# EAGLE schematic ttl-nixie-clock (EAGLE 7.4.0)
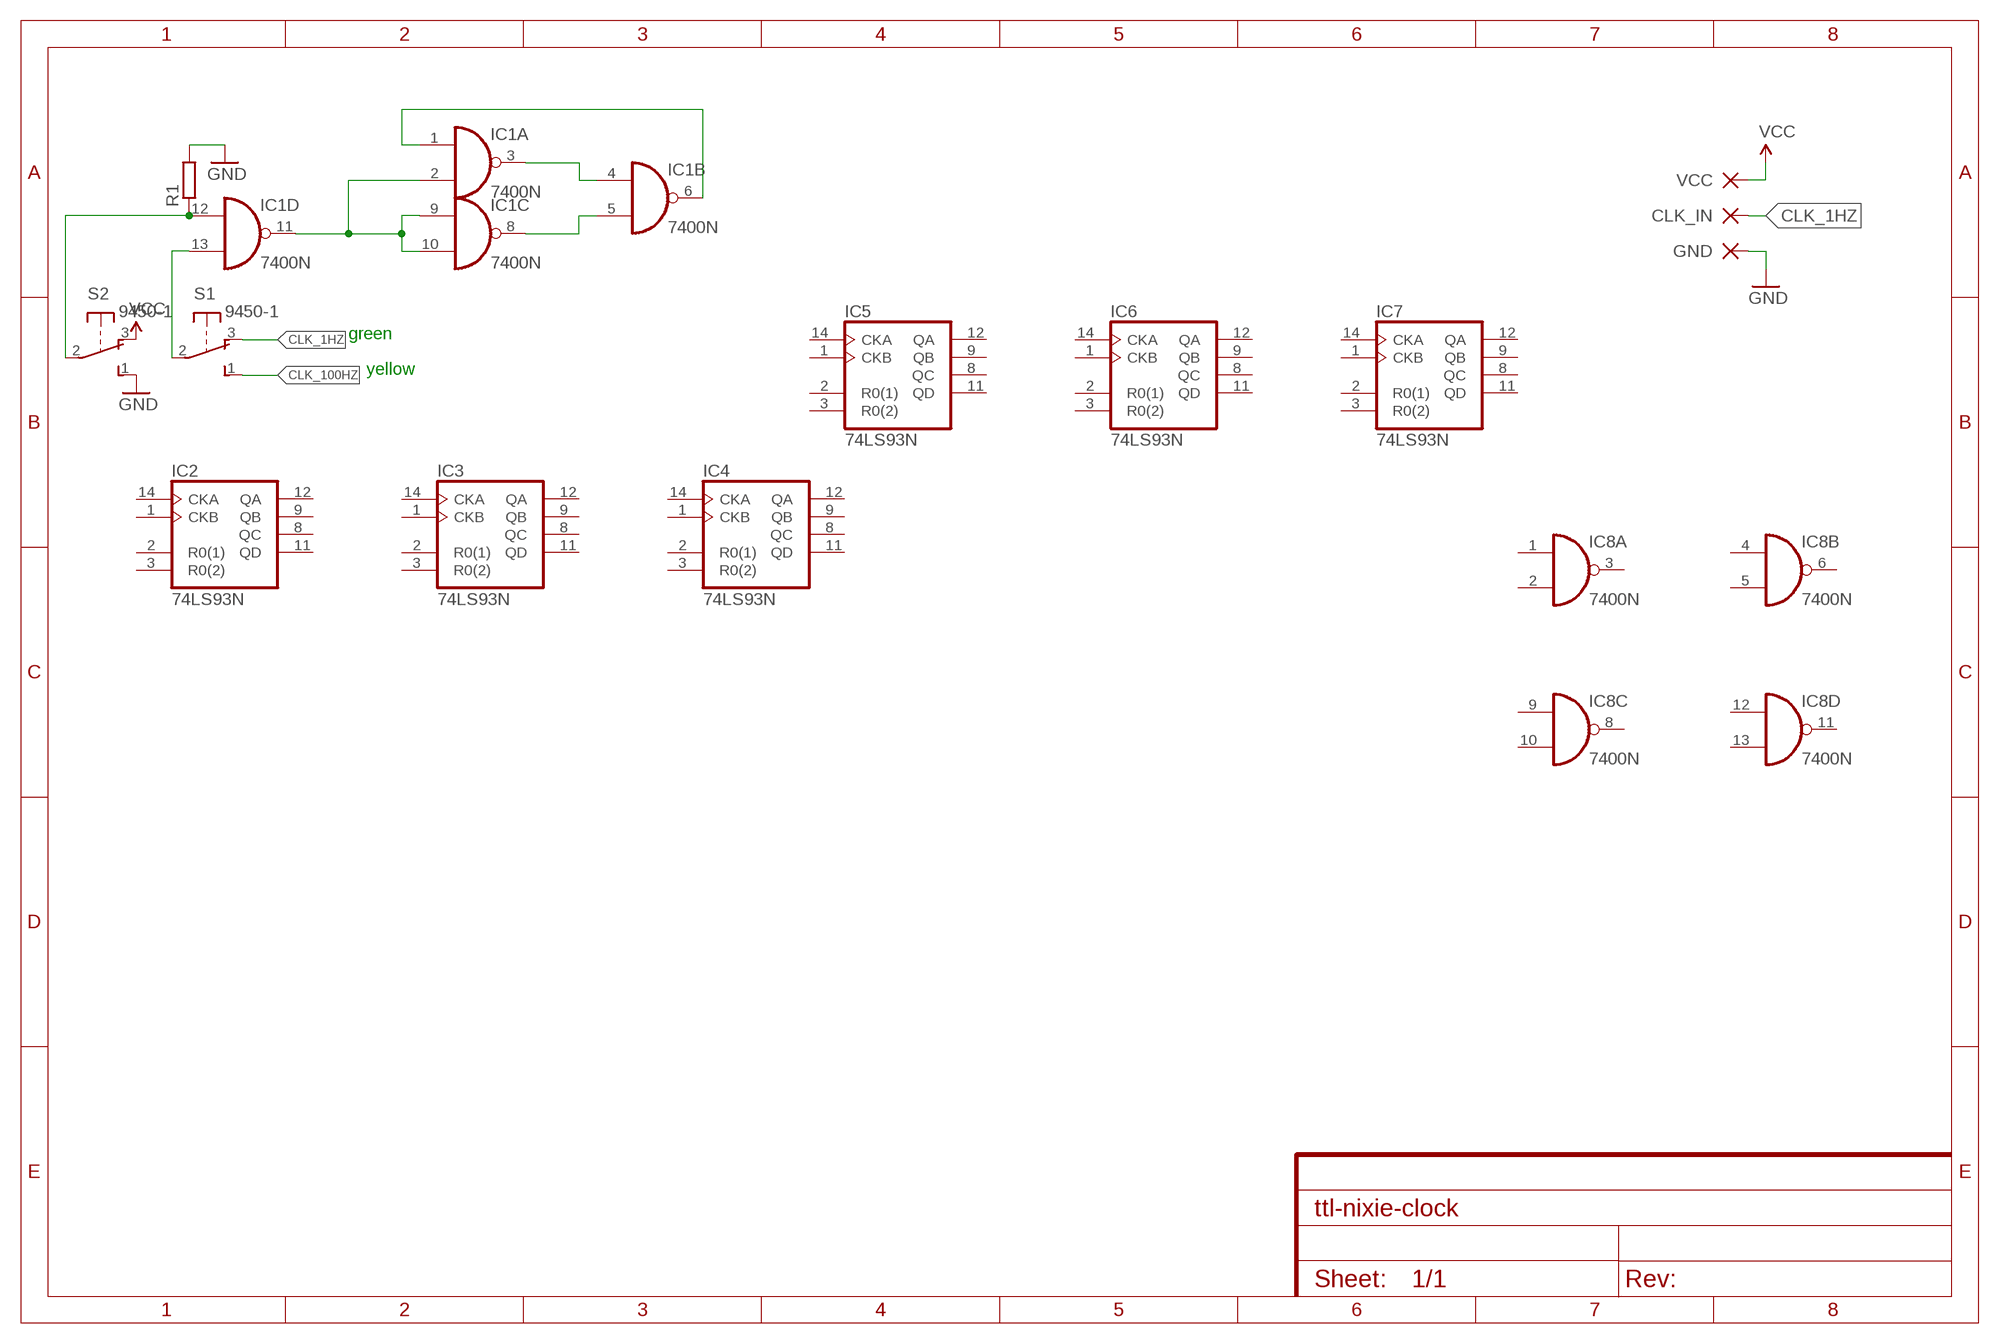
[diagram p0: schematic, sheet 1]

## Parts
CLK_IN  CLK_OUT  2,15/1,0  [2,15/1,0]
GND  GND  2,15/1,0  [2,15/1,0]
IC1  7400N  [DIL14]
IC2  74LS93N  [DIL14]
IC3  74LS93N  [DIL14]
IC4  74LS93N  [DIL14]
IC5  74LS93N  [DIL14]
IC6  74LS93N  [DIL14]
IC7  74LS93N  [DIL14]
IC8  7400N  [DIL14]
R1  R-EU_0207/12  [0207/12]
S1  9450-1  [9450-1]
S2  9450-1  [9450-1]
VCC  VCC  2,15/1,0  [2,15/1,0]

## Nets
BLACK: IC1.13(D:I1) S1.2(P)
CLK_1HZ: CLK_IN.1(P) S1.3(O)
CLK_100HZ: S1.1(S)
GND: GND.1(P) R1.2 S2.1(S)
N$1: IC1.5(B:I1) IC1.8(C:O)
N$2: IC1.2(A:I1) IC1.9(C:I0) IC1.10(C:I1) IC1.11(D:O)
N$4: IC1.3(A:O) IC1.4(B:I0)
N$5: IC1.1(A:I0) IC1.6(B:O)
VCC: S2.3(O) VCC.1(P)
WHITE: IC1.12(D:I0) R1.1 S2.2(P)
Unconnected: IC2.1(CKB) IC2.2(R0(1)) IC2.3(R0(2)) IC2.8(QC) IC2.9(QB) IC2.11(QD) IC2.12(QA) IC2.14(CKA) IC3.1(CKB) IC3.2(R0(1)) IC3.3(R0(2)) IC3.8(QC) IC3.9(QB) IC3.11(QD) IC3.12(QA) IC3.14(CKA) IC4.1(CKB) IC4.2(R0(1)) IC4.3(R0(2)) IC4.8(QC) IC4.9(QB) IC4.11(QD) IC4.12(QA) IC4.14(CKA) IC5.1(CKB) IC5.2(R0(1)) IC5.3(R0(2)) IC5.8(QC) IC5.9(QB) IC5.11(QD) IC5.12(QA) IC5.14(CKA) IC6.1(CKB) IC6.2(R0(1)) IC6.3(R0(2)) IC6.8(QC) IC6.9(QB) IC6.11(QD) IC6.12(QA) IC6.14(CKA) IC7.1(CKB) IC7.2(R0(1)) IC7.3(R0(2)) IC7.8(QC) IC7.9(QB) IC7.11(QD) IC7.12(QA) IC7.14(CKA) IC8.1(A:I0) IC8.2(A:I1) IC8.3(A:O) IC8.4(B:I0) IC8.5(B:I1) IC8.6(B:O) IC8.8(C:O) IC8.9(C:I0) IC8.10(C:I1) IC8.11(D:O) IC8.12(D:I0) IC8.13(D:I1)

## Notes on the sheet
- green
- yellow

## Power pins joined to a net without a drawn wire
GND: IC1.7(P:GND) IC2.10(GND) IC3.10(GND) IC4.10(GND) IC5.10(GND) IC6.10(GND) IC7.10(GND) IC8.7(P:GND)
VCC: IC1.14(P:VCC) IC2.5(VCC) IC3.5(VCC) IC4.5(VCC) IC5.5(VCC) IC6.5(VCC) IC7.5(VCC) IC8.14(P:VCC)

## Library data of the parts
CLK_IN GND VCC = wirepad:2,15/1,0: THROUGH-HOLE PAD
IC1 IC8 = 74xx-eu:74*00: Quad 2-input NAND gate
IC2-IC7 = 74xx-eu:74*93: Decade, divide by twelve and binary COUNTER
R1 = resistor:R-EU_: RESISTOR, European symbol
S1 S2 = switch-misc:9450-1: MARQUARDT SWITCH